# EAGLE design Spectacle_Button_Board (EAGLE 7.6.0)
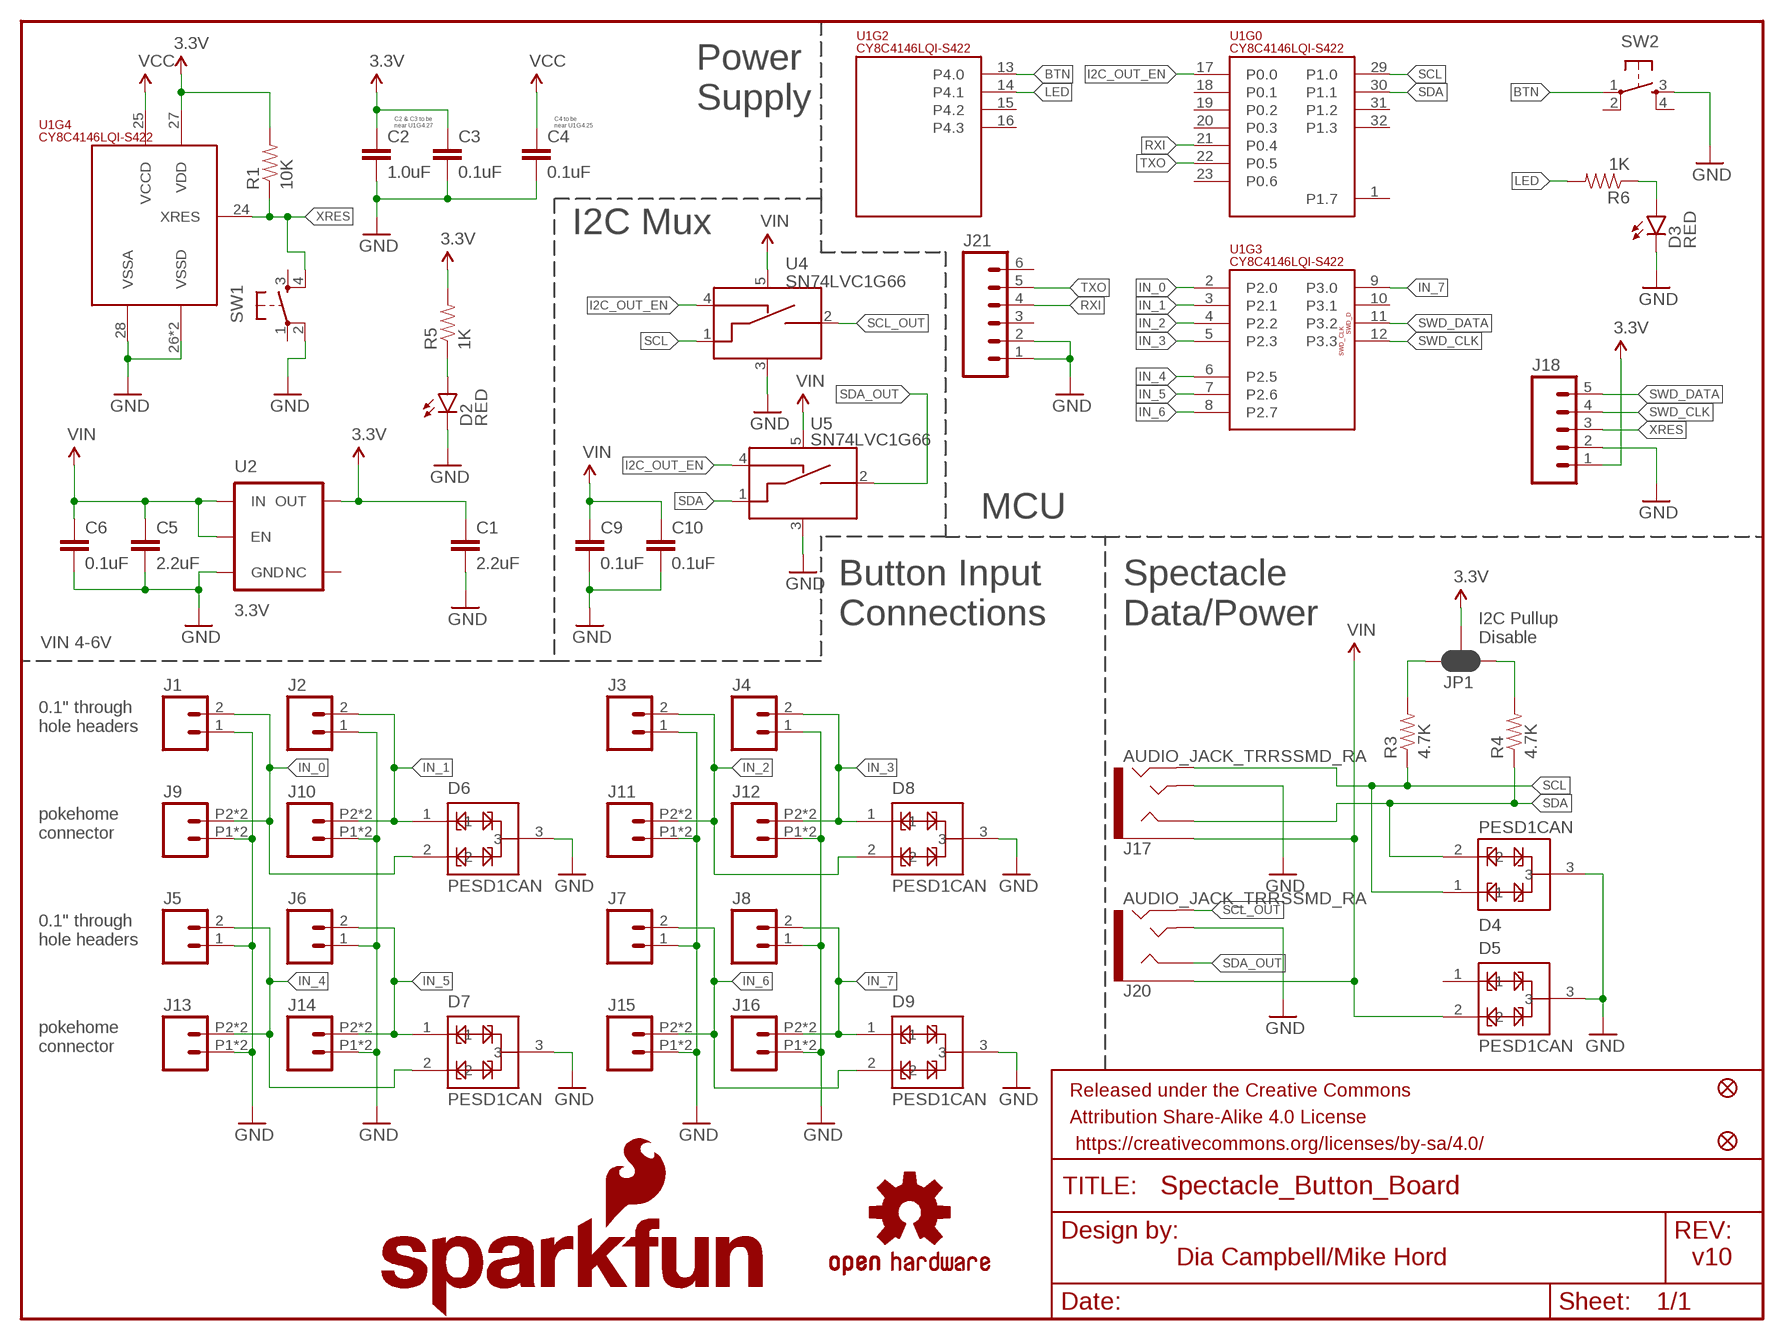
[diagram p0: schematic, sheet 1]

## Parts
C1  2.2uF  2.2UF-10V-20%(0603)  [0603-CAP]
C2  1.0uF  1.0UF-16V-10%(0402)  [0402-CAP]
C3  0.1uF  0.1UF-16V(+-10%)(0402)  [0402-CAP]
C4  0.1uF  0.1UF-16V(+-10%)(0402)  [0402-CAP]
C5  2.2uF  2.2UF-10V-20%(0603)  [0603-CAP]
C6  0.1uF  0.1UF-16V(+-10%)(0402)  [0402-CAP]
C9  0.1uF  0.1UF-16V(+-10%)(0402)  [0402-CAP]
C10  0.1uF  0.1UF-16V(+-10%)(0402)  [0402-CAP]
D2  RED  LED-RED0603  [LED-0603]
D3  RED  LED-RED0603  [LED-0603]
D4  PESD1CAN  [SOT23-3]
D5  PESD1CAN  [SOT23-3]
D6  PESD1CAN  [SOT23-3]
D7  PESD1CAN  [SOT23-3]
D8  PESD1CAN  [SOT23-3]
D9  PESD1CAN  [SOT23-3]
FD1  FIDUCIALUFIDUCIAL  [MICRO-FIDUCIAL]
FD2  FIDUCIALUFIDUCIAL  [MICRO-FIDUCIAL]
FRAME1  FRAME-LETTER  [CREATIVE_COMMONS]
J1  M02PTH  [1X02]
J2  M02PTH  [1X02]
J3  M02PTH  [1X02]
J4  M02PTH  [1X02]
J5  M02PTH  [1X02]
J6  M02PTH  [1X02]
J7  M02PTH  [1X02]
J8  M02PTH  [1X02]
J9  M02SMALL_POKEHOME  [1X02_POKEHOME]
J10  M02SMALL_POKEHOME  [1X02_POKEHOME]
J11  M02SMALL_POKEHOME  [1X02_POKEHOME]
J12  M02SMALL_POKEHOME  [1X02_POKEHOME]
J13  M02SMALL_POKEHOME  [1X02_POKEHOME]
J14  M02SMALL_POKEHOME  [1X02_POKEHOME]
J15  M02SMALL_POKEHOME  [1X02_POKEHOME]
J16  M02SMALL_POKEHOME  [1X02_POKEHOME]
J17  AUDIO_JACK_TRRSSMD_RA  [AUDIO_JACK_3.5MM_TRRS_SMD_RA]
J18  M05NO_SILK  [1X05_NO_SILK]
J20  AUDIO_JACK_TRRSSMD_RA  [AUDIO_JACK_3.5MM_TRRS_SMD_RA]
J21  M06NO_SILK_NO_POP  [1X06_NO_SILK]
JP1  JUMPER-PAD-3-NC_BY_PASTE  [PAD-JUMPER-3-NC_BY_PASTE_YES_SILK_FULL_BOX]
LOGO1  OSHW-LOGOM  [OSHW-LOGO-M]
LOGO2  SFE_LOGO_NAME_FLAME.1_INCH  [SFE_LOGO_NAME_FLAME_.1]
R1  10K  10KOHM-1/10W-1%(0603)0603  [0603-RES]
R3  4.7K  4.7KOHM-1/10W-1%(0603)  [0603-RES]
R4  4.7K  4.7KOHM-1/10W-1%(0603)  [0603-RES]
R5  1K  1KOHM-1/10W-1%(0603)  [0603-RES]
R6  1K  1KOHM-1/10W-1%(0603)  [0603-RES]
SW1  SWITCH_SPST_4_PINRECT  [TACTILE_SWITCH_SMD_4.6X2.8MM]
SW2  SWITCH_SPST_4_PINRECT  [TACTILE_SWITCH_SMD_4.6X2.8MM]
U1  CY8C4146LQI-S422  PSOC4_4100S_32QFN  [QFN-32]
U2  3.3V  V_REG_AP2112K-3.3V  [SOT23-5]
U4  SN74LVC1G66  SN74LVC1G66_SPST_AMUX  [SOT23-5]
U5  SN74LVC1G66  SN74LVC1G66_SPST_AMUX  [SOT23-5]

## Nets
3.3V: C1.1 C2.1 C3.1 J18.1 JP1.2 R1.2 R5.2 U1.27(VDD) U2.5(OUT)
BTN: SW2.1 U1.13(P4.0)
GND: C1.2 C2.2 C3.2 C4.2 C5.2 C6.2 C9.2 C10.2 D2.C D3.C D4.3 D5.3 D6.3 D7.3 D8.3 D9.3 J1.1 J2.1 J3.1 J4.1 J5.1 J6.1 J7.1 J8.1 J9.P1 J9.P3 J10.P1 J10.P3 J11.P1 J11.P3 J12.P1 J12.P3 J13.P1 J13.P3 J14.P1 J14.P3 J15.P1 J15.P3 J16.P1 J16.P3 J17.TIP J18.2 J20.TIP J21.1 J21.2 SW1.2 SW2.3 U1.26(VSSD) U1.28(VSSA) U1.EP(VSSD) U2.2(GND) U4.3(VSS) U5.3(VSS)
I2C_OUT_EN: U1.17(P0.0) U4.4(CTRL_IN) U5.4(CTRL_IN)
IN_0: D6.2 J1.2 J9.P2 J9.P4 U1.2(P2.0)
IN_1: D6.1 J2.2 J10.P2 J10.P4 U1.3(P2.1)
IN_2: D8.2 J3.2 J11.P2 J11.P4 U1.4(P2.2)
IN_3: D8.1 J4.2 J12.P2 J12.P4 U1.5(P2.3)
IN_4: D7.2 J5.2 J13.P2 J13.P4 U1.6(P2.5)
IN_5: D7.1 J6.2 J14.P2 J14.P4 U1.7(P2.6)
IN_6: D9.2 J7.2 J15.P2 J15.P4 U1.8(P2.7)
IN_7: D9.1 J8.2 J16.P2 J16.P4 U1.9(P3.0)
LED: R6.2 U1.14(P4.1)
N$2: JP1.3 R3.2
N$4: D2.A R5.1
N$5: D3.A R6.1
N$6: JP1.1 R4.2
RXI: J21.4 U1.21(P0.4)
SCL: D4.1 J17.RING2 R3.1 U1.29(P1.0) U4.1(A_IN)
SCL_OUT: J20.RING2 U4.2(A_OUT)
SDA: D4.2 J17.RING1 R4.1 U1.30(P1.1) U5.1(A_IN)
SDA_OUT: J20.RING1 U5.2(A_OUT)
SWD_CLK: J18.4 U1.12(P3.3)
SWD_DATA: J18.5 U1.11(P3.2)
TXO: J21.5 U1.22(P0.5)
VCC: C4.1 U1.25(VCCD)
VIN: C5.1 C6.1 C9.1 C10.1 D5.2 J17.EARTH J20.EARTH U2.1(IN) U2.3(EN) U4.5(VCC) U5.5(VCC)
XRES: J18.3 R1.1 SW1.4 U1.24(XRES)
Unconnected: D5.1 J21.3 J21.6 SW1.1 SW1.3 SW2.2 SW2.4 U1.1(P1.7) U1.10(P3.1) U1.15(P4.2) U1.16(P4.3) U1.18(P0.1) U1.19(P0.2) U1.20(P0.3) U1.23(P0.6) U1.31(P1.2) U1.32(P1.3) U2.4(NC)

## Notes on the sheet
- Power
  Supply
- C2 & C3 to be
  near U1G4.27
- C4 to be
  near U1G4.25
- I2C Mux
- MCU
- Button Input
  Connections
- Spectacle
  Data/Power
- I2C Pullup
  Disable
- VIN 4-6V
- 0.1" through
  hole headers
- pokehome
  connector
- 0.1" through
  hole headers
- pokehome
  connector
- Dia Campbell/Mike Hord | v10

## Library data of the parts
C1 C5 = SparkFun-Capacitors:2.2UF-10V-20%(0603): CAP-07888; PROD_ID: CAP-07888
C2 = SparkFun-Capacitors:1.0UF-16V-10%(0402); PROD_ID: CAP-12417
C3 C4 C6 C9 C10 = SparkFun-Capacitors:0.1UF-16V(+-10%)(0402); PROD_ID: CAP-12416
D2 D3 = SparkFun-LED:LED-RED: Assorted Red LEDs LilyPad 1206- DIO-09912 1206- DIO-00809 0603- DIO-00819 "SMART" means more efficient and expensive; PROD_ID: DIO-00819
D4-D9 = SparkFun-DiscreteSemi:PESD1CAN: PESD1CAN is used to protect two automotive CAN bus lines from ESD.; PROD_ID: DIO-12501
FD1 FD2 = SparkFun-Aesthetics:FIDUCIAL: Fiducial Alignment Points Various fiducial points for machine vision alignment.
FRAME1 = SparkFun-Aesthetics:FRAME-LETTER: Schematic Frame Standard 8.5x11 US Letter frame
J1-J8 = SparkFun-Connectors:M02: Standard 2-pin 0.1" header. Use with - straight break away headers ( PRT-00116) - right angle break away headers (PRT-00553) - swiss pins (PRT-00743) - machine pins (PRT-00117) - female headers (PRT-00115) Molex polarized connector foot print use with: PRT-08233 with associated crimp pins and housings. 2.54_SCREWTERM for use with PRT-10571. 3.5mm Screw Terminal footprints for PRT-08084 5mm Screw Terminal footprints for use with PRT-08432
J9-J16 = SparkFun-Connectors:M02: Standard 2-pin 0.1" header. Use with - straight break away headers ( PRT-00116) - right angle break away headers (PRT-00553) - swiss pins (PRT-00743) - machine pins (PRT-00117) - female headers (PRT-00115) Molex polarized connector foot print use with: PRT-08233 with associated crimp pins and housings. 2.54_SCREWTERM for use with PRT-10571. 3.5mm Screw Terminal footprints for PRT-08084 5mm Screw Terminal footprints for use with PRT-08432; PROD_ID: CONN-13512
J17 J20 = SparkFun-Connectors:AUDIO_JACK_TRRS: Audio Jack - 3.5mm TRRS (SMD) This is a 3.5mm TRRS SMD audio jack. TRRS connectors are the audio-style connectors that you see on some phones, MP3 players and development boards. TRRS stands for “tip, ring, ring, sleeve,” which reflects that this has three conductors and a ground. SparkFun Products: Audio Jack <https://www.sparkfun.com/products/12639> mbed Starter Kit <https://www.sparkfun.com/products/12968> SparkFun TRRS 3.5mm Jack Breakout <https://www.sparkfun.com/products/11570>; PROD_ID: CONN-10676; SF_ID: PRT-12639
J18 = SparkFun-Connectors:M05: Header 5 Standard 5-pin 0.1" header. Use with straight break away headers (SKU : PRT-00116), right angle break away headers (PRT-00553), swiss pins (PRT-00743), machine pins (PRT-00117), and female headers (PRT-00115). Molex polarized connector foot print use with SKU : PRT-08230 with associated crimp pins and housings.
J21 = SparkFun-Connectors:M06: Header 6 Standard 6-pin 0.1" header. Use with straight break away headers (SKU : PRT-00116), right angle break away headers (PRT-00553), swiss pins (PRT-00743), machine pins (PRT-00117), and female headers (PRT-00115). Molex polarized connector foot print use with SKU : PRT-08094 with associated crimp pins and housings. NOTES ON THE VARIANTS LOCK and LOCK_LONGPADS... This footprint was designed to help hold the alignment of a through-hole component (i.e. 6-pin header) while soldering it into place. You may notice that each hole has been shifted either up or down by 0.005 of an inch from it's more standard position (which is a perfectly straight line). This slight alteration caused the pins (the squares in the middle) to touch the edges of the holes. Because they are alternating, it causes a "brace" to hold the component in place. 0.005 has proven to be the perfect amount of "off-center" position when using our standard breakaway headers. Although looks a little odd when you look at the bare footprint, once you have a header in there, the alteration is very hard to notice. Also,if you push a header all the way into place, it is covered up entirely on the bottom side. This idea of altering the position of holes to aid alignment will be further integrated into the Sparkfun Library for other footprints. It can help hold any component with 3 or more connection pins.
JP1 = SparkFun-Passives:JUMPER-PAD-3-NC_BY_PASTE
LOGO1 = SparkFun-Aesthetics:OSHW-LOGO: Open Source Hardware Logo This logo indicates the piece of hardware it is found on incorporates a OSHW license and/or adheres to the definition of open source hardware found here: http://freedomdefined.org/OSHW
LOGO2 = SparkFun-Aesthetics:SFE_LOGO_NAME_FLAME: SFE Logo, name and flame This is the SparkFun full logo. The logo on the schematic will always be the same size; the package variant is the height of the flame part of the logo. Default layer for the logo on the board is tSilk.
R1 = SparkFun-Resistors:10KOHM-1/10W-1%(0603): RES-00824; PROD_ID: RES-00824
R3 R4 = SparkFun-Resistors:4.7KOHM-1/10W-1%(0603): RES-07857; PROD_ID: RES-07857
R5 R6 = SparkFun-Resistors:1KOHM-1/10W-1%(0603): RES-07856; PROD_ID: RES-07856
SW1 SW2 = SparkFun-Electromechanical:SWITCH_SPST_4_PIN; PROD_ID: SWCH-13065
U1 = SparkFun-DigitalIC:PSOC4_4100S_32QFN; PROD_ID: IC-13286
U2 = SparkFun-PowerIC:V_REG_AP2112: AP2112 - 600mA CMOS LDO Regulator w/ Enable The AP2112 is CMOS process low dropout linear regulator with enable function, the regulator delivers a guaranteed 600mA (min.) continuous load current. Features Output Voltage Accuracy: ±1.5% Output Current: 600mA (Min.) Foldback Short Current Protection: 50mA Enable Function to Turn ON/OFF VOUT Low Dropout Voltage (3.3V): 250mV (Typ.) @IOUT=600mA Excellent Load Regulation: 0.2%/A (Typ.) Excellent Line Regulation: 0.02%/V (Typ.) Low Quiescent Current: 55μA (Typ.) Low Standby Current: 0.01μA (Typ.) Low Output Noise: 50μVRMS PSRR: 100Hz -65dB, 1kHz -65dB OTSD Protection Stable with 1.0μF Flexible Cap: Ceramic, Tantalum and Aluminum Electrolytic Operation Temperature Range: -40°C to 85°C ESD: MM 400V, HBM 4000V; PROD_ID: VREG-12457
U4 U5 = SparkFun-AnalogIC:SN74LVC1G66_SPST_AMUX: SPST NO Analog Switch 10-Ohm on resistance 1.65-5.5V; PROD_ID: IC-13549

## Board
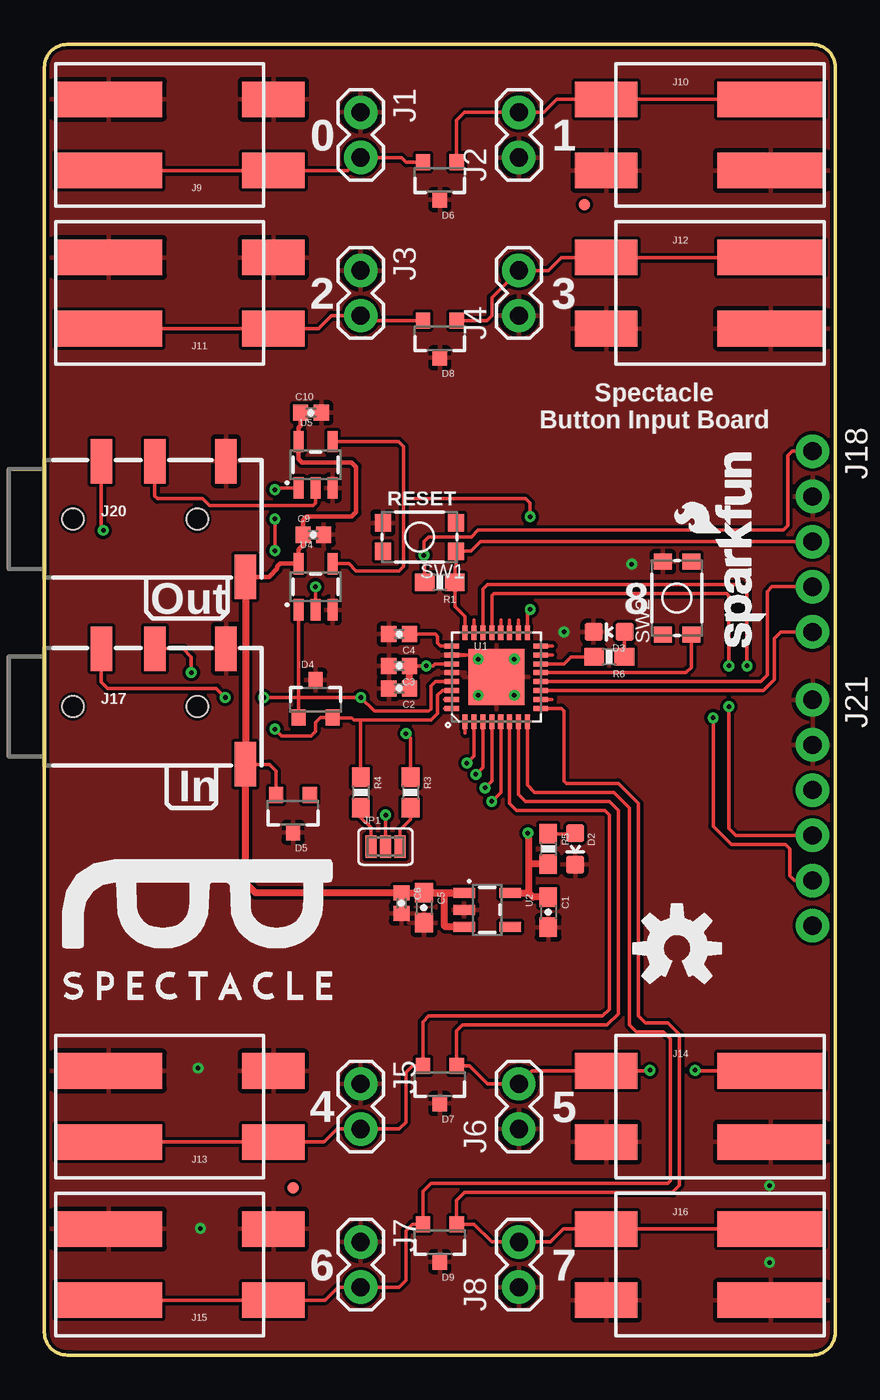
[diagram p1: board, top side]
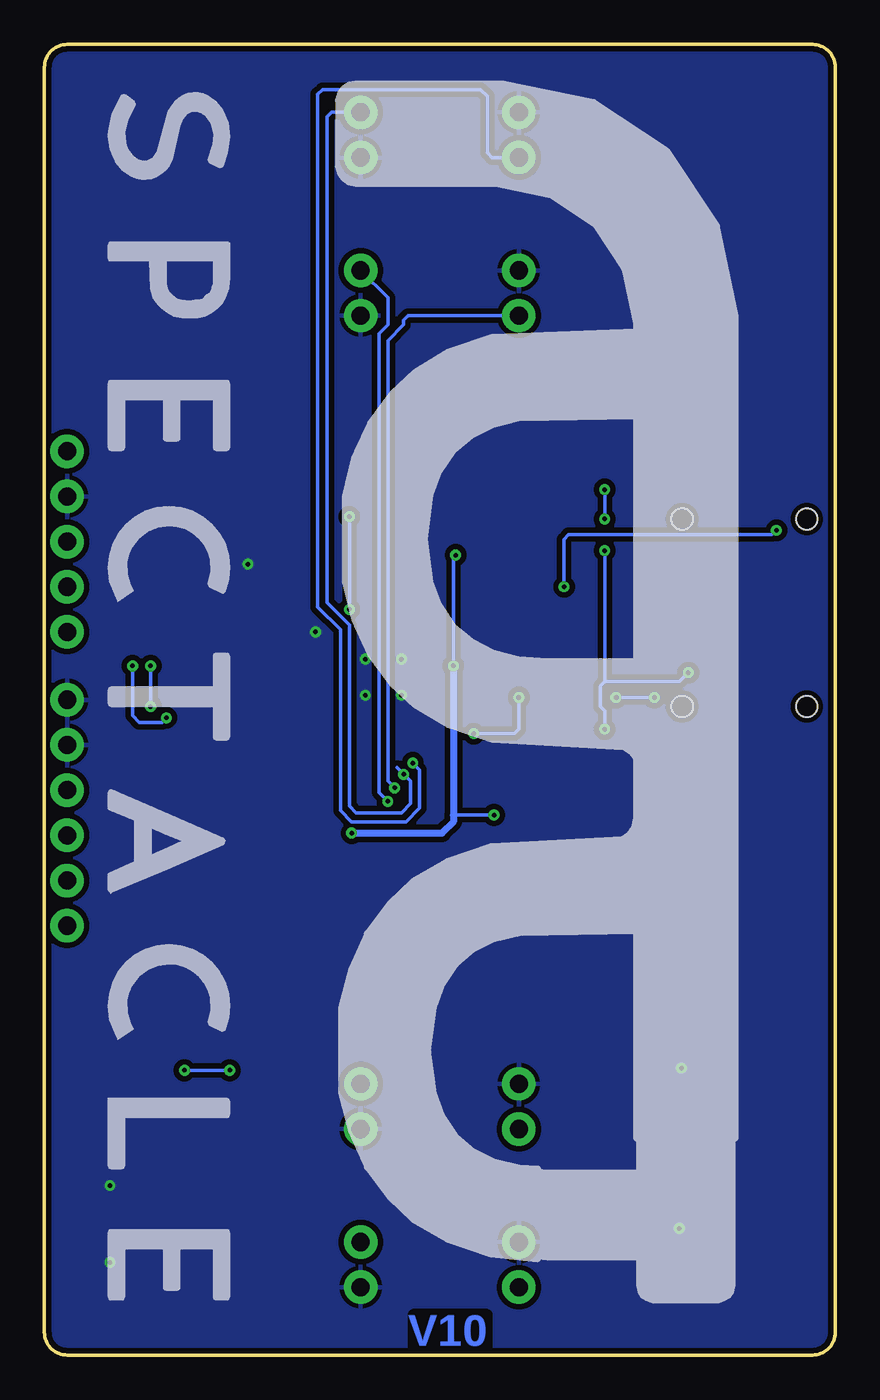
[diagram p2: board, bottom side, seen from below]

Size 44.45 x 73.66 mm. Coordinates in mm from the lower left corner, seen from the top.
Outline: 0,72.39 0,1.27 arc90 1.27,0 1.52,0 43.18,0 arc90 44.45,1.27 44.45,72.39 arc90 43.18,73.66 1.27,73.66 arc90 0,72.39
Copper layers (1*16): Top 0.035mm / dielectric 1.5mm / Bottom 0.035mm
Design rules "SparkFun-2-layer-TIGHT *": minimum track width 7mil, minimum drill 10mil, track to track 7mil, track to pad 7mil, pad to pad 7mil, via to via 7mil, smd to smd 7mil, copper to edge 7mil, drill to drill 7mil, minimum pad ring 7mil, minimum via ring 7mil, stop-mask expansion 4mil, vias tented up to drill 25mil, thermal gap 10mil

### Footprints (pad centres in the part's own frame; a part is rotated, then mirrored left to right if it is on the bottom)
0603-CAP = smd 1.1 x 1: 1 -0.85,0; 2 0.85,0
0402-CAP = smd 0.85 x 0.9: 1 -0.58,0; 2 0.58,0
LED-0603 = smd 1 x 1: A 0,-0.877; C 0,0.877
SOT23-3 = smd 0.8 x 0.9: 1 -0.95,-1; 2 0.95,-1; 3 0,1.1
MICRO-FIDUCIAL = smd 0.635 x 0.635: 1 0,0
1X02 = drill 1.016 pad 1.88: 1 0,0; 2 2.54,0
1X02_POKEHOME = smd 3.5 x 2: P1 5.25,2; P2 5.25,-2 | smd 6 x 2: P3 -4,2; P4 -4,-2
AUDIO_JACK_3.5MM_TRRS_SMD_RA = smd 1.2 x 2.5: EARTH 11.3,-3.25; RING1 6.2,3.25; RING2 3.2,3.25; TIP 10.2,3.25 | hole 1.2: 1.6,0; 8.6,0
1X05_NO_SILK = drill 1.016 pad 1.88: 1 0,0; 2 2.54,0; 3 5.08,0; 4 7.62,0; 5 10.16,0
1X06_NO_SILK = drill 1.016 pad 1.88: 1 0,0; 2 2.54,0; 3 5.08,0; 4 7.62,0; 5 10.16,0; 6 12.7,0
PAD-JUMPER-3-NC_BY_PASTE_YES_SILK_FULL_BOX = smd 0.635 x 1.27: 1 -0.813,0; 2 0,0; 3 0.813,0
0603-RES = smd 1.1 x 1: 1 -0.85,0; 2 0.85,0
TACTILE_SWITCH_SMD_4.6X2.8MM = smd 0.9 x 1: 1 -2.05,-0.8; 2 2.05,-0.8; 3 2.05,0.8; 4 -2.05,0.8
QFN-32 = smd 0.285 x 0.8: 1 -1.75,-2.5; 2 -1.25,-2.5; 3 -0.75,-2.5; 4 -0.25,-2.5; 5 0.25,-2.5; 6 0.75,-2.5; 7 1.25,-2.5; 8 1.75,-2.5; 17 1.75,2.5; 18 1.25,2.5; 19 0.75,2.5; 20 0.25,2.5; 21 -0.25,2.5; 22 -0.75,2.5; 23 -1.25,2.5; 24 -1.75,2.5 | smd 0.8 x 0.285: 9 2.5,-1.75; 10 2.5,-1.25; 11 2.5,-0.75; 12 2.5,-0.25; 13 2.5,0.25; 14 2.5,0.75; 15 2.5,1.25; 16 2.5,1.75; 25 -2.5,1.75; 26 -2.5,1.25; 27 -2.5,0.75; 28 -2.5,0.25; 29 -2.5,-0.25; 30 -2.5,-0.75; 31 -2.5,-1.25; 32 -2.5,-1.75 | smd 3.15 x 3.15: EP 0,0
SOT23-5 = smd 0.55 x 1.2: 1 -0.95,-1.3; 2 0,-1.3; 3 0.95,-1.3; 4 0.95,1.3; 5 -0.95,1.3

### Placement (x,y rotation side)
C1  28.32,24.89 270 top
C2  19.94,37.47 180 top
C3  19.94,38.73 180 top
C4  19.94,40.51 180 top
C5  21.34,25.15 270 top
C6  20.07,25.4 270 top
C9  15.11,46.1 0 top
C10  14.99,52.96 0 top
D2  29.84,28.45 180 top
D3  31.75,40.64 90 top
D4  15.24,36.83 0 top
D5  13.97,30.48 180 top
D6  22.23,66.04 180 top
D7  22.23,15.24 180 top
D8  22.23,57.15 180 top
D9  22.23,6.35 180 top
FD1  30.35,64.64 0 top
FD2  13.97,9.4 0 top
FRAME1  -66.04,-16.51 0 top  (outside the outline)
J1  17.78,69.85 270 top
J2  26.67,67.31 90 top
J3  17.78,60.96 270 top
J4  26.67,58.42 90 top
J5  17.78,15.24 270 top
J6  26.67,12.7 90 top
J7  17.78,6.35 270 top
J8  26.67,3.81 90 top
J9  7.62,68.58 0 top
J10  36.83,68.58 180 top
J11  7.62,59.69 0 top
J12  36.83,59.69 180 top
J13  7.62,13.97 0 top
J14  36.83,13.97 180 top
J15  7.62,5.08 0 top
J16  36.83,5.08 180 top
J17  0,36.45 0 top
J18  43.18,50.8 270 top
J20  0,46.99 0 top
J21  43.18,36.83 270 top
JP1  19.18,28.57 0 top
LOGO1  35.56,22.86 0 top
LOGO2  40.64,39.37 90 top
R1  22.23,43.43 180 top
R3  20.57,31.62 270 top
R4  17.78,31.62 270 top
R5  28.32,28.45 270 top
R6  31.75,39.24 180 top
SW1  21.08,45.97 180 top
SW2  35.56,42.55 90 top
U1  25.4,38.1 0 top
U2  24.89,25.02 270 top
U4  15.24,43.18 0 top
U5  15.24,50.04 0 top

### Tracks (layer width: path | path; a pad name or v marks a point on that pad's centre or on a via)
3.3V  (via drill 0.25)
  Top 0.203: C3.1 v21.46,38.73 21.84,38.73 21.96,38.85 U1.27 | R1.2 21.38,44.92 v21.34,44.96 21.34,45.72 21.59,45.97 24,45.97 24.38,46.35 41.53,46.35 41.78,46.61 41.78,50.55 42.04,50.8 J18.1 | JP1.2 v19.18,30.35
  Top 0.406: C2.1 C3.1 | U2.5 27.24,25.97 | 27.24,25.97 27.47,25.74 C1.1 | R5.2 27.28,27.6 27.24,27.56 | 27.24,25.97 27.24,27.56 | 27.24,27.56 27.24,29.27 v27.18,29.34
  Bottom 0.203: v21.46,38.73 21.46,44.83 v21.34,44.96 | v19.18,30.35 21.46,30.35
  Bottom 0.406: v27.18,29.34 22.1,29.34 21.46,29.97 21.46,30.35 v21.46,38.73
BTN
  Top 0.203: U1.13 36.06,38.35 36.36,38.65 SW2.1
GND  (via drill 0.25)
  Top 0.203: v24.38,37.08 U1.EP | U1.26 24.15,39.35 v24.38,39.12
  other vias: 33.02,44.45 29.21,40.64 26.42,39.12 26.42,37.08 40.77,9.53 40.77,5.21 8.76,7.11 8.64,16.13
  pour Bottom (isolate 0.305): 1.27,73.66 43.18,73.66 arc-90 44.45,72.39 44.45,1.27 arc-90 43.18,0 1.27,0 arc-90 0,1.27 0,72.39 arc-90
  pour Top: 44.45,1.27 44.45,72.39 arc90 43.18,73.66 1.27,73.66 arc90 0,72.39 0,1.27 arc90 1.27,0 43.18,0 arc90
I2C_OUT_EN  (via drill 0.25)
  Top 0.203: U1.17 27.15,41.76 v27.3,41.91 | v27.3,47.12 27.3,47.88 27.05,48.13 20.19,48.13 | 20.19,48.13 20.19,51.05 19.91,51.34 U5.4 | 20.19,48.13 20.19,44.32 19.94,44.07 17.53,44.07 17.11,44.48 U4.4
  Bottom 0.203: v27.3,41.91 v27.3,47.12
IN_0  (via drill 0.25)
  Top 0.203: U1.2 24.15,33.67 v23.75,33.27 | D6.2 20.34,67.04 20.07,67.31 J1.2 17.05,66.58 J9.P2 J9.P4
  Bottom 0.203: v23.75,33.27 23.37,32.89 23.37,30.73 24.13,29.97 27.18,29.97 27.81,30.61 27.81,40.77 29.08,42.04 29.08,70.87 28.83,71.12 19.94,71.12 19.56,70.74 19.56,67.56 19.3,67.31 J1.2
IN_1  (via drill 0.25)
  Top 0.203: U1.3 24.65,33.03 v24.26,32.64 | J10.P4 J10.P2 28.8,70.58 28.07,69.85 J2.2 23.62,69.85 23.18,69.4 D6.1
  Bottom 0.203: 24.64,33.02 v24.26,32.64 23.88,32.26 23.88,30.99 24.38,30.48 26.92,30.48 27.3,30.86 27.3,41.02 28.57,42.29 28.57,69.6 28.32,69.85 J2.2
IN_2  (via drill 0.25)
  Top 0.203: U1.4 25.15,32.26 v24.77,31.88 | J11.P4 J11.P2 15.4,57.69 16.13,58.42 J3.2 18.05,58.15 D8.2
  Bottom 0.203: v24.77,31.88 25.15,32.26 25.15,57.02 24.26,57.91 24.26,58.17 24,58.42 J3.2
IN_3  (via drill 0.25)
  Top 0.203: U1.5 25.65,31.62 v25.15,31.11 | D8.1 24.88,58.15 25.15,58.42 25.15,59.44 J4.2 28.32,60.96 29.05,61.69 J12.P2 J12.P4
  Bottom 0.203: v25.15,31.11 25.65,31.62 25.65,57.4 25.15,57.91 25.15,59.44 J4.2
IN_4
  Top 0.203: U1.6 26.15,31 26.54,30.61 31.5,30.61 31.75,30.35 31.75,19.43 31.37,19.05 21.59,19.05 21.27,18.73 D7.2 20.68,16.24 20.32,15.88 20.32,13.08 19.94,12.7 J5.2 16.45,12.7 15.72,11.97 J13.P2 J13.P4
IN_5  (via drill 0.25)
  Top 0.203: U1.7 26.65,31.52 27.05,31.11 31.75,31.11 32.26,30.61 32.26,19.18 31.62,18.54 23.5,18.54 23.18,18.22 D7.1 23.89,16.24 24.89,15.24 J6.2 27.4,15.97 J14.P2 34,15.97 v34.04,16 | J14.P4 36.61,15.97 v36.58,16
  Bottom 0.203: v34.04,16 v36.58,16
IN_6
  Top 0.203: U1.8 27.15,32.03 27.56,31.62 32,31.62 32.89,30.73 32.89,18.54 33.27,18.16 34.8,18.16 35.18,17.78 35.18,9.78 35.05,9.65 21.72,9.65 21.27,9.21 D9.2 20.68,7.35 20.32,6.99 20.32,4.19 19.94,3.81 J7.2 16.51,3.81 15.78,3.08 J15.P2 J15.P4
IN_7
  Top 0.203: U1.9 29.05,36.35 29.21,36.2 29.21,32.26 29.34,32.13 32.26,32.13 33.4,30.99 33.4,19.05 33.78,18.67 35.05,18.67 35.69,18.03 35.69,9.53 35.31,9.14 23.62,9.14 23.18,8.7 D9.1 24.15,7.35 25.15,6.35 J8.2 28.45,6.35 29.18,7.08 32.12,7.08 | J16.P2 31.58,7.62 32.12,7.08 | J16.P4 32.12,7.08
LED
  Top 0.203: U1.14 29.2,38.85 29.59,39.24 R6.2
N$1
  Top 0.203: 24.15,40.78 24.15,41.3
N$2
  Top 0.203: JP1.3 19.99,29.52 20.57,30.1 R3.2
N$4
  Top 0.203: R5.1 29.82,29.3 D2.A
N$5
  Top 0.203: R6.1 32.6,40.61 D3.A
N$6
  Top 0.203: JP1.1 18.36,29.64 17.78,30.23 R4.2
N$7
  Top 0.203: 25.65,40.68 25.65,41.3
N$8
  Top 0.203: 26.15,40.62 26.15,41.31
N$9
  Top 0.203: 26.65,40.65 26.65,41.31
N$10
  Top 0.203: 28.01,39.85 28.57,39.85
N$12
  Top 0.203: 28,39.35 28.55,39.35
N$13
  Top 0.203: 27.84,36.85 28.54,36.85
N$14
  Top 0.203: 23.65,35.64 23.65,34.95
N$15
  Top 0.203: 22.99,36.35 22.49,36.35
N$16
  Top 0.203: 23.03,36.85 22.48,36.85
RXI  (via drill 0.25)
  Top 0.203: U1.21 25.15,42.68 25.27,42.8 38.35,42.8 38.48,42.67 v38.48,38.73 | v38.48,36.45 38.48,29.59 38.86,29.21 J21.4
  Bottom 0.203: v38.48,38.73 v38.48,36.45
SCL  (via drill 0.25)
  Top 0.203: U1.29 21.98,37.85 21.72,37.59 21.72,36.32 21.59,36.2 18.54,36.2 v17.78,36.96 14.22,36.96 | J17.RING2 3.2,37.82 3.56,37.47 9.65,37.47 v10.16,36.96 | v12.32,36.96 14.22,36.96 | D4.1 14.29,36.89 14.22,36.96 | U4.1 14.29,37.02 14.22,36.96 | R3.1 20.57,34.67 v20.32,34.92
  Bottom 0.203: v10.16,36.96 v12.32,36.96 | v20.32,34.92 18.03,34.92 17.78,35.18 v17.78,36.96
SCL_OUT  (via drill 0.25)
  Top 0.203: U4.2 v15.24,43.18 | J20.RING2 3.2,46.46 v3.3,46.35
  Bottom 0.203: v15.24,43.18 15.24,45.85 14.99,46.1 3.56,46.1 v3.3,46.35
SDA  (via drill 0.25)
  Top 0.203: U1.30 22.36,37.35 22.1,37.08 22.1,36.07 21.72,35.69 17.78,35.69 | 17.78,35.69 17.4,35.69 17.27,35.81 16.21,35.81 D4.2 15.51,35.83 15.24,35.56 15.24,35.05 14.99,34.8 13.34,34.8 v12.95,35.18 | v8.26,38.35 8.26,39.24 7.8,39.7 J17.RING1 | R4.1 17.78,35.69 | v12.95,45.21 v12.95,46.99 | U5.1 13.05,48.74 v12.95,48.64
  Bottom 0.203: v12.95,35.18 12.95,36.2 13.21,36.45 13.21,37.59 12.95,37.85 | 12.95,37.85 8.76,37.85 v8.26,38.35 | 12.95,37.85 v12.95,45.21 | v12.95,46.99 v12.95,48.64
SDA_OUT
  Top 0.203: U5.2 15.24,47.88 15.11,47.75 9.27,47.75 8.89,48.13 6.35,48.13 6.2,48.28 J20.RING1
SWD_CLK
  Top 0.203: U1.12 40.26,37.85 40.64,38.23 40.64,42.93 40.89,43.18 J18.4
SWD_DATA
  Top 0.203: U1.11 40.4,37.35 41.02,37.97 41.02,40.26 41.4,40.64 J18.5
TXO  (via drill 0.25)
  Top 0.203: U1.22 24.65,43.06 24.89,43.31 39.12,43.31 39.5,42.93 v39.5,38.73 | v37.59,35.81 37.59,29.72 38.61,28.7 41.66,28.7 41.91,28.45 41.91,26.92 42.16,26.67 J21.5
  Bottom 0.203: v39.5,38.73 39.5,35.94 39.12,35.56 37.85,35.56 v37.59,35.81
VCC
  Top 0.203: U1.25 22.25,39.85 22.1,40.01 22.1,40.39 21.97,40.51 C4.1
VIN
  Top 0.203: D5.2 13.02,32.83 12.65,33.2 J17.EARTH
  Top 0.254: J20.EARTH 12.62,43.74 13.08,44.2 13.08,44.32 13.24,44.48 U4.5 14.28,45.27 14.53,45.52 C9.1 14.53,46.92 14.73,47.12 17.27,47.12 17.53,47.37 17.53,49.91 17.27,50.16 14.48,50.16 14.29,50.35 U5.5 14.29,52.14 14.41,52.25 C10.1
  Top 0.406: J20.EARTH J17.EARTH 11.3,26.54 11.87,25.98 C6.1 22.48,25.98 | 22.48,25.98 22.86,25.98 | 22.86,25.98 U2.1 | U2.3 22.54,24.07 22.48,24.13 22.48,25.98 | C5.1 22.84,26 22.86,25.98
XRES
  Top 0.203: U1.24 23.65,41.5 23.07,42.08 R1.1 23.07,44.28 23.13,44.34 SW1.4 23.96,45.17 24.51,45.72 J18.3

### Text on the board
Bottom: V10
tPlace: 0 | 1 | 2 | 3 | Spectacle / Button Input Board | RESET | Out | 8 | In | 4 | 5 | 6 | 7
Measures: (typical) | Dimensions in inches
tDocu: Mike Hord and Dia Campbell